# EAGLE design Micromouse (EAGLE 8.1.1)
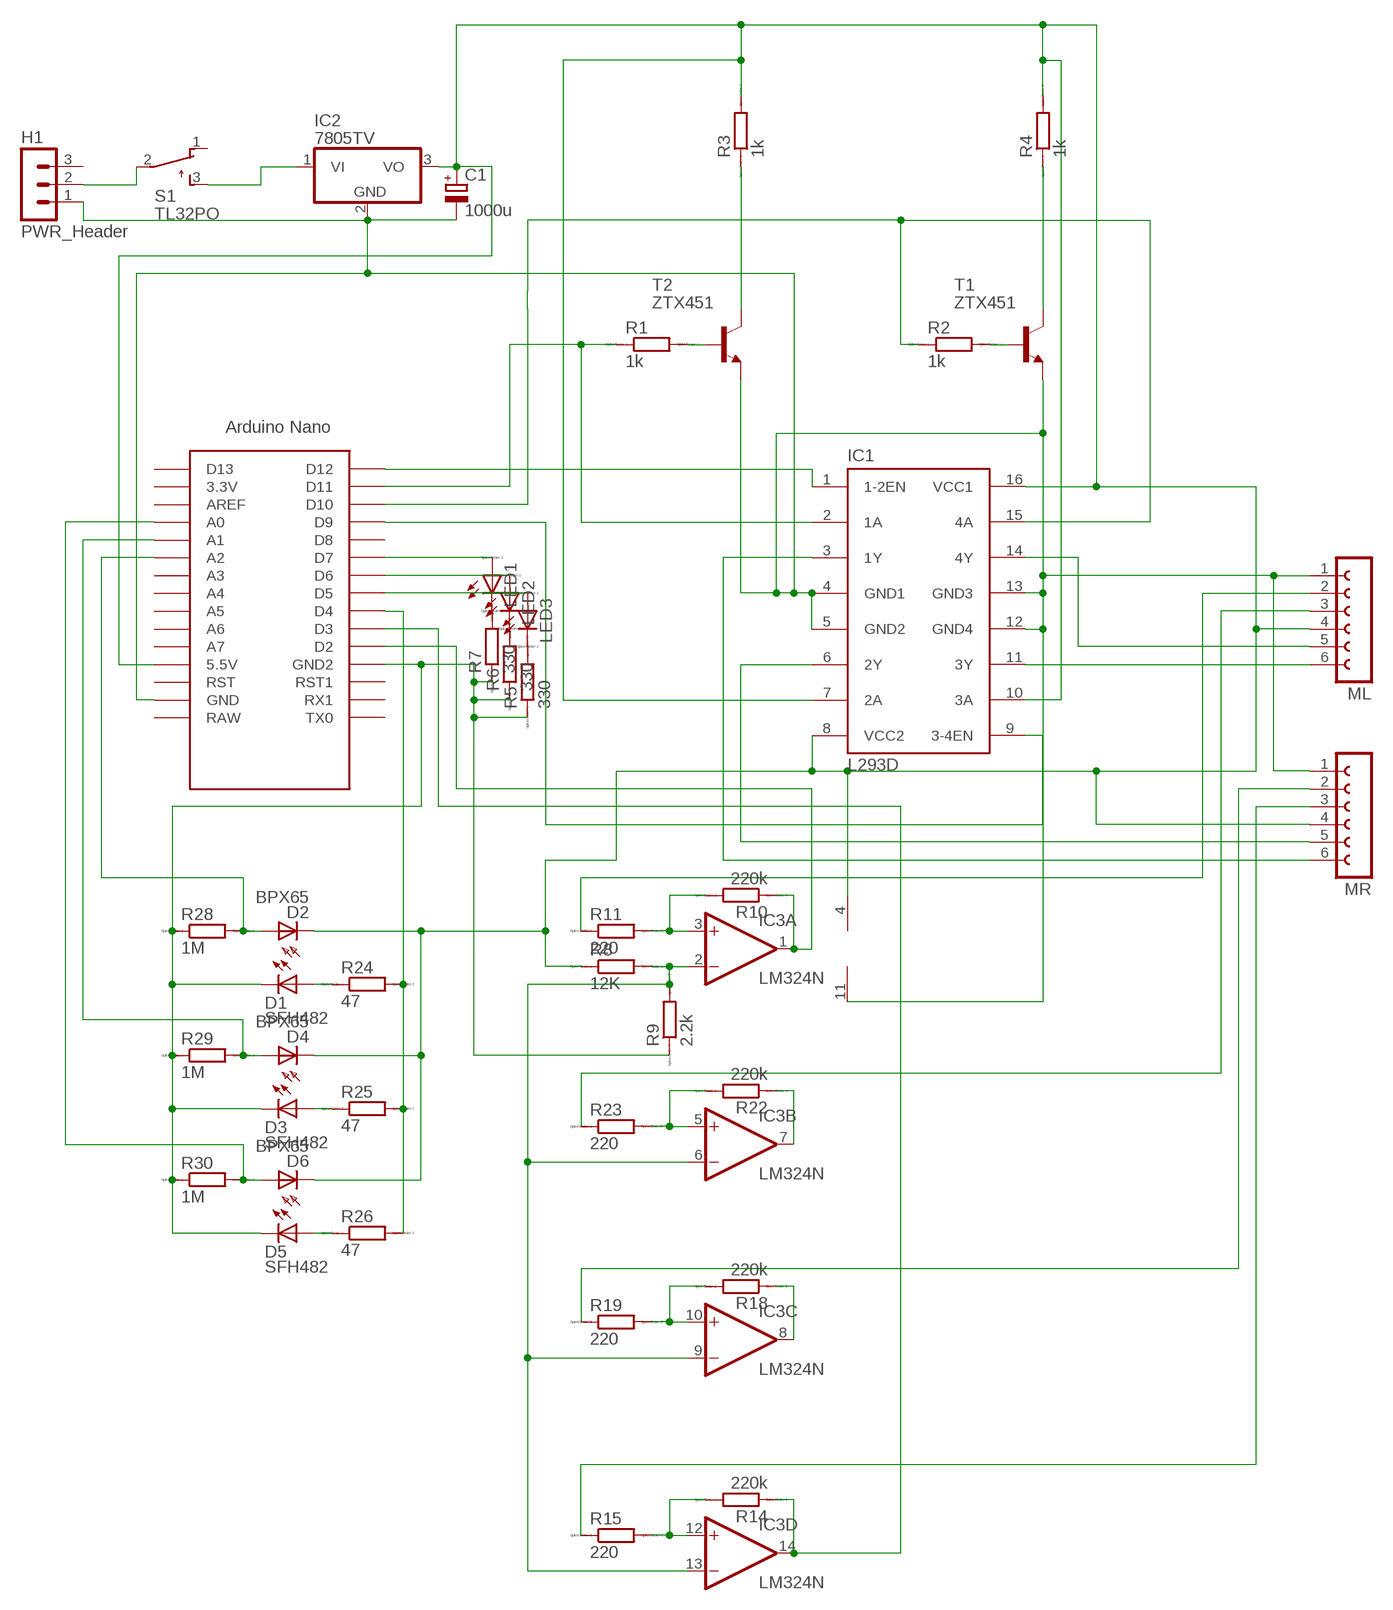
[diagram p0: schematic, sheet 1]

## Parts
C1  1000u  CPOL-EUE3.5-10  [E3,5-10]
D1  SFH482  [SFH482]
D2  BPX65  [BPX65]
D3  SFH482  [SFH482]
D4  BPX65  [BPX65]
D5  SFH482  [SFH482]
D6  BPX65  [BPX65]
H1  PWR_Header  MA03-1  [MA03-1]
IC1  L293D  [DIL16]
IC2  7805TV  [TO220V]
IC3  LM324N  [DIL14]
LED1  LED_ELD260  [LED_LD260]
LED2  LED_ELD260  [LED_LD260]
LED3  LED_ELD260  [LED_LD260]
ML  FE06-1  [FE06]
MR  FE06-1  [FE06]
R1  1k  R0204/7  [0204/7]
R2  1k  R0204/7  [0204/7]
R3  1k  R0204/7  [0204/7]
R4  1k  R0204/7  [0204/7]
R5  330  R0204/7  [0204/7]
R6  330  R0204/7  [0204/7]
R7  330  R0204/7  [0204/7]
R8  12K  R0204/7  [0204/7]
R9  2.2k  R0204/7  [0204/7]
R10  220k  R0204/7  [0204/7]
R11  220  R0204/7  [0204/7]
R14  220k  R0204/7  [0204/7]
R15  220  R0204/7  [0204/7]
R18  220k  R0204/7  [0204/7]
R19  220  R0204/7  [0204/7]
R22  220k  R0204/7  [0204/7]
R23  220  R0204/7  [0204/7]
R24  47  R0204/7  [0204/7]
R25  47  R0204/7  [0204/7]
R26  47  R0204/7  [0204/7]
R28  1M  R0204/7  [0204/7]
R29  1M  R0204/7  [0204/7]
R30  1M  R0204/7  [0204/7]
S1  TL32PO  [TL3XPO]
T1  ZTX451  BC238  [TO92]
T2  ZTX451  BC238  [TO92]
U$1  NANO  [NANO]

## Nets
5V: C1.+ D2.K(C) D4.K(C) D6.K(C) IC1.8(VCC2) IC1.10(3A) IC1.16(VCC1) IC2.3(VO) IC3.4(P:V+) ML.4 MR.4 R3.2 R4.2 R8.1 U$1.5V(5.5V)
GND: C1.- D1.K(C) D3.K(C) D5.K(C) H1.1 IC1.4(GND1) IC1.5(GND2) IC1.12(GND4) IC1.13(GND3) IC2.2(GND) IC3.11(P:V-) ML.1 MR.1 R5.1 R6.1 R7.1 R9.1 R28.1 R29.1 R30.1 T1.1(E) T2.1(E) U$1.GND U$1.GND1(GND2)
N$1: IC1.11(3Y) ML.6
N$2: IC1.14(4Y) ML.5
N$3: IC1.3(1Y) MR.6
N$4: IC1.6(2Y) MR.5
N$5: R1.2 T2.2(B)
N$6: R2.2 T1.2(B)
N$7: IC1.15(4A) R2.1 U$1.D10
N$8: IC1.2(1A) R1.1 U$1.D11
N$9: H1.2 S1.2(P)
N$10: IC1.1(1-2EN) U$1.D12
N$11: R3.1 T2.3(C)
N$12: R4.1 T1.3(C)
N$13: IC3.7(B:OUT) R22.1
N$15: LED3.K(C) R5.2
N$16: IC1.9(3-4EN) U$1.D9
N$19: LED2.K(C) R6.2
N$20: LED1.K(C) R7.2
N$22: IC3.1(A:OUT) R10.1 U$1.D2
N$23: IC3.3(A:+IN) R10.2 R11.2
N$24: LED1.A U$1.D7
N$25: LED2.A U$1.D6
N$26: LED3.A U$1.D5
N$27: IC3.2(A:-IN) IC3.6(B:-IN) IC3.9(C:-IN) IC3.13(D:-IN) R8.2 R9.2
N$28: IC3.8(C:OUT) R18.1
N$29: ML.2 R11.1
N$30: ML.3 R23.1
N$31: IC3.14(D:OUT) R14.1 U$1.D3
N$32: IC3.12(D:+IN) R14.2 R15.2
N$34: MR.2 R19.1
N$35: MR.3 R15.1
N$36: R24.2 R25.2 R26.2 U$1.D4
N$37: IC3.10(C:+IN) R18.2 R19.2
N$39: D4.A R29.2 U$1.A1
N$40: D5.A R26.1
N$42: IC3.5(B:+IN) R22.2 R23.2
N$44: D3.A R25.1
N$45: D1.A R24.1
N$46: D2.A R28.2 U$1.A2
N$48: D6.A R30.2 U$1.A0
VI: IC2.1(VI) S1.3(S)
Unconnected: H1.3 IC1.7(2A) S1.1(O) U$1.3.3V U$1.A3 U$1.A4 U$1.A5 U$1.A6 U$1.A7 U$1.AREF U$1.D8 U$1.D13 U$1.ICSP1 U$1.ICSP2 U$1.ICSP3 U$1.ICSP4 U$1.ICSP5 U$1.ICSP6 U$1.RAW U$1.RST U$1.RST1 U$1.RX1 U$1.TX0

## Library data of the parts
C1 = resistor:CPOL-EU: POLARIZED CAPACITOR, European symbol
D1 D3 D5 = led:SFH482: IR LED infrared emitting diode, Infineon
D2 D4 D6 = opto-trans-siemens:BPX65: PHOTO DIODE; MPN: BPX65.; OC_FARNELL: 327451; OC_NEWARK: 06WX2764
H1 = con-lstb:MA03-1: PIN HEADER; OC_FARNELL: unknown; OC_NEWARK: unknown
IC1 = st-microelectronics:L293D: PUSH-PULL 4 CHANNEL DRIVER; MPN: L293D; OC_FARNELL: 9589619; OC_NEWARK: 56P8249
IC2 = linear:78*: Positive VOLTAGE REGULATOR Source: http://cache.national.com/ds/LM/LM78L05.pdf http://www.fairchildsemi.com/ds/LM/LM7805.pdf
IC3 = linear:LM324: OP AMP
LED1-LED3 = eagle-ltspice:LED_E: LED Source: http://www.osram.convergy.de Source: www.luxeon.com Source: www.kingbright.com; SPICEMODEL: NONE; SPICEPREFIX: D; SPICETYPE: diode
ML MR = con-lsta:FE06-1: FEMALE HEADER; OC_FARNELL: unknown; OC_NEWARK: unknown
R1-R11 R14 R15 R18 R19 R22-R26 R28-R30 = eagle-ltspice:R: RESISTOR, European symbol; SPICEMODEL: NONE; SPICEPREFIX: R
S1 = switch:TL32PO: TINY SWITCH ON - MOM Source: http://www2.produktinfo.conrad.com/datenblaetter/700000-724999/705152-da-01-de-Subminiaturschalter_TL_36YO.pdf
T1 T2 = transistor:BC238: NPN TRANSISTOR
U$1 = Arduino-clone:NANO: Arduino Nano

## Board
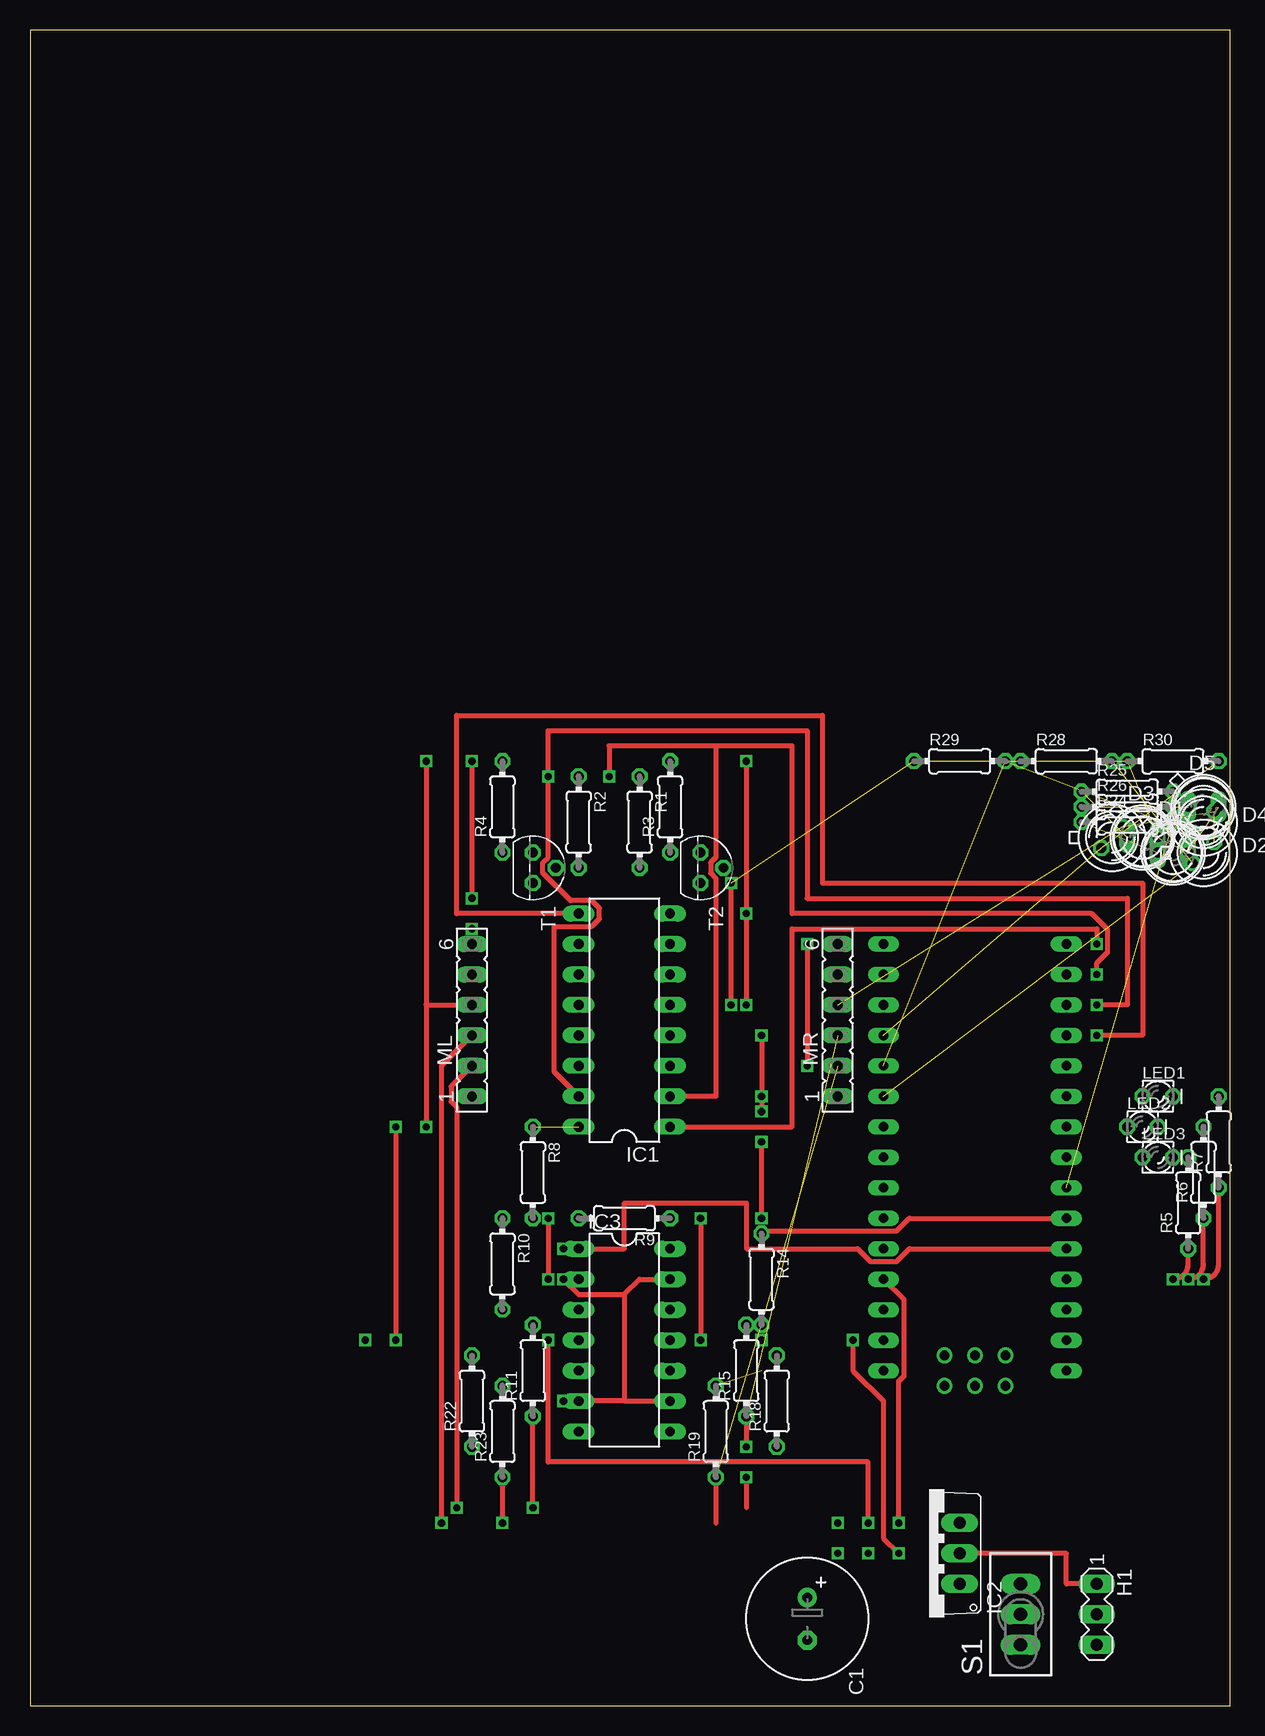
[diagram p1: board, top side]
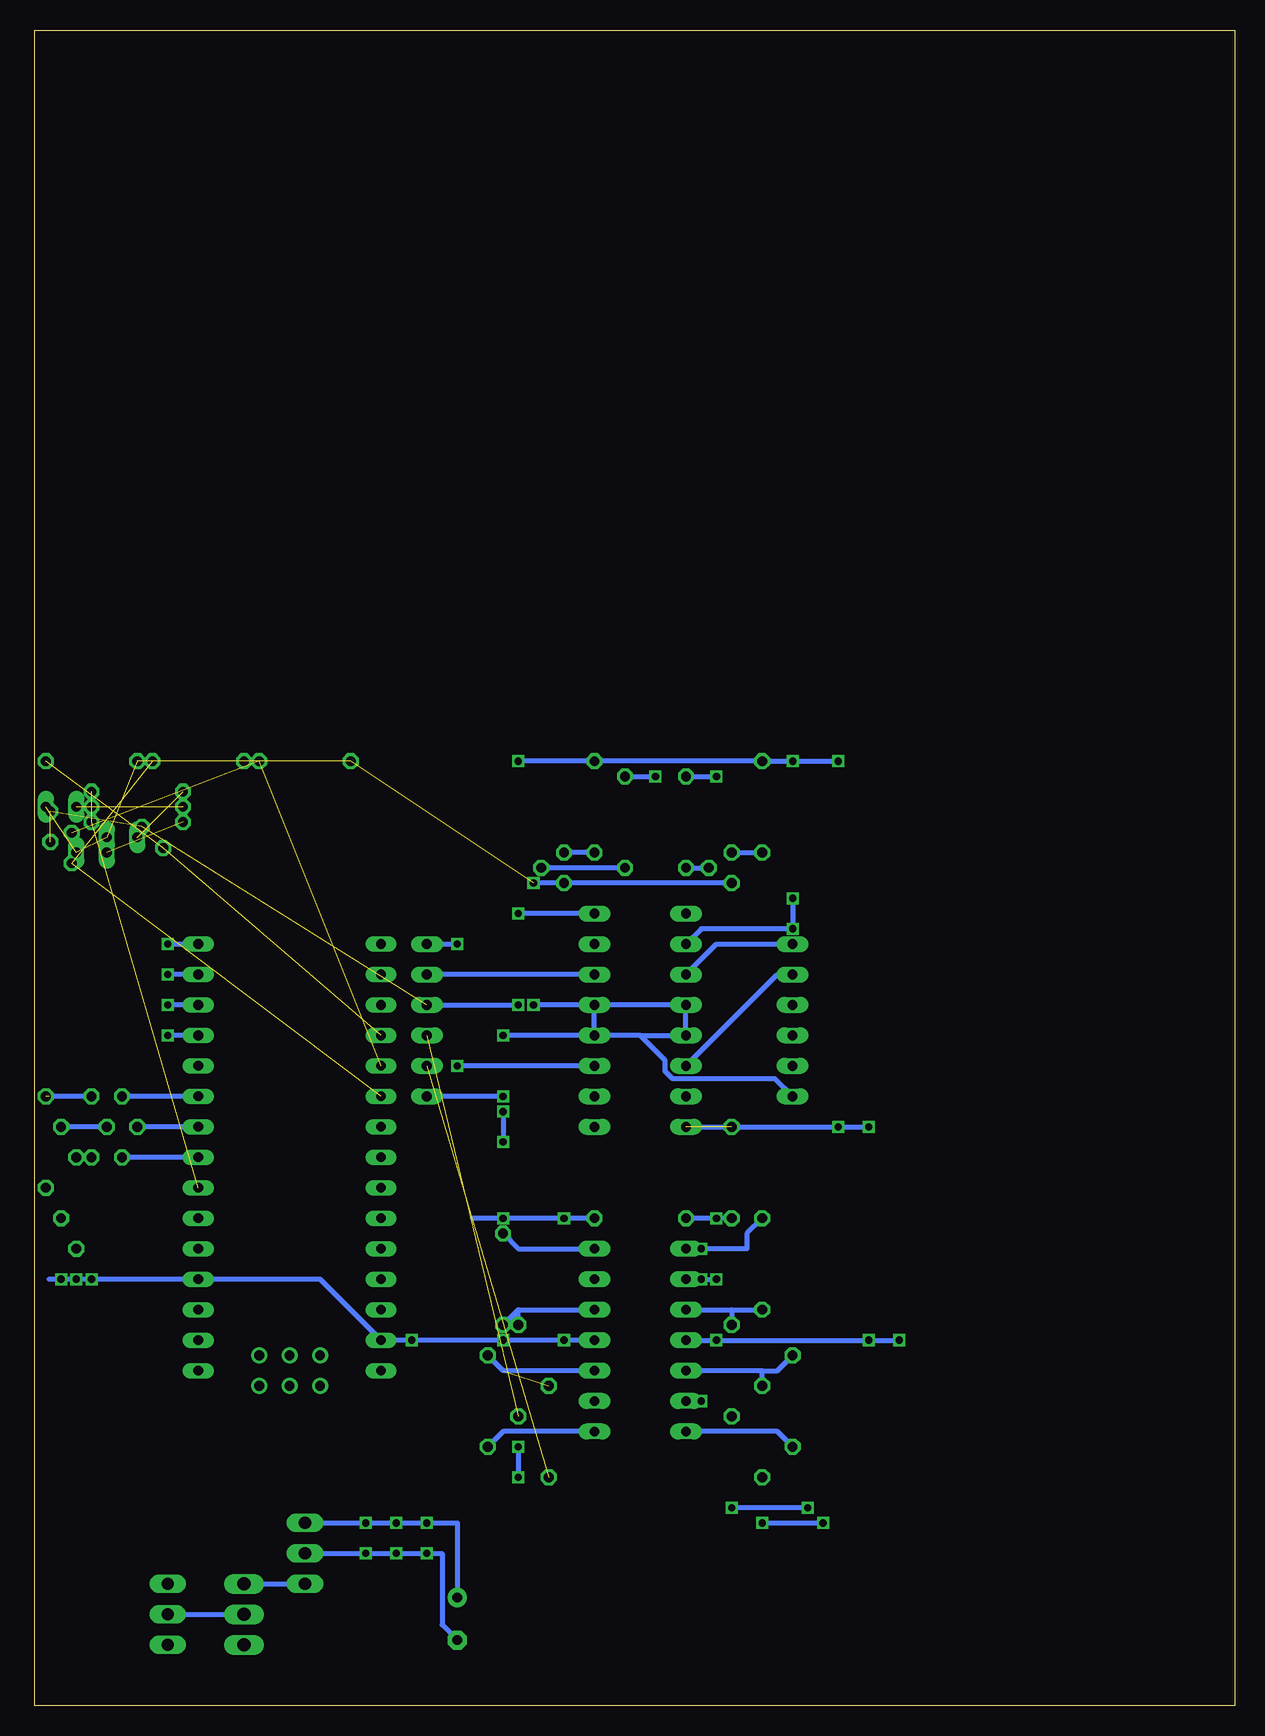
[diagram p2: board, bottom side, seen from below]

Size 100 x 139.69 mm. Coordinates in mm from the lower left corner, seen from the top.
Outline: 0,0 100,0 100,139.69 0,139.69 0,0
Copper layers (1*16): Top 0.035mm / dielectric 1.5mm / Bottom 0.035mm
Design rules "default": minimum track width 10mil, minimum drill 24mil, track to track 8mil, track to pad 8mil, pad to pad 8mil, via to via 8mil, smd to smd 8mil, copper to edge 40mil, drill to drill 8mil, minimum pad ring 10mil, minimum via ring 8mil, stop-mask expansion 4mil, vias tented up to drill 0mil, thermal gap 10mil

### Footprints (pad centres in the part's own frame; a part is rotated, then mirrored left to right if it is on the bottom)
E3,5-10 = drill 0.813 pad 1.6: + -1.778,0 | drill 0.813 pad 1.6 octagon: - 1.778,0
SFH482 = drill 0.813 long: A -1.27,0; K 1.27,0
BPX65 = drill 0.813 octagon: A -0.889,-0.889; K 0.889,0.889
MA03-1 = drill 1.016 long: 1 -2.54,0; 2 0,0; 3 2.54,0
DIL16 = drill 0.813 long: 1 -8.89,-3.81; 2 -6.35,-3.81; 3 -3.81,-3.81; 4 -1.27,-3.81; 5 1.27,-3.81; 6 3.81,-3.81; 7 6.35,-3.81; 8 8.89,-3.81; 9 8.89,3.81; 10 6.35,3.81; 11 3.81,3.81; 12 1.27,3.81; 13 -1.27,3.81; 14 -3.81,3.81; 15 -6.35,3.81; 16 -8.89,3.81
TO220V = drill 1.016 long: 1 -2.54,-2.54; 2 0,-2.54; 3 2.54,-2.54
DIL14 = drill 0.813 long: 1 -7.62,-3.81; 2 -5.08,-3.81; 3 -2.54,-3.81; 4 0,-3.81; 5 2.54,-3.81; 6 5.08,-3.81; 7 7.62,-3.81; 8 7.62,3.81; 9 5.08,3.81; 10 2.54,3.81; 11 0,3.81; 12 -2.54,3.81; 13 -5.08,3.81; 14 -7.62,3.81
LED_LD260 = drill 0.813 octagon: A -1.27,0; K 1.27,0
FE06 = drill 0.813 long: 1 -6.35,0; 2 -3.81,0; 3 -1.27,0; 4 1.27,0; 5 3.81,0; 6 6.35,0
0204/7 = drill 0.813 octagon: 1 -3.81,0; 2 3.81,0
TL3XPO = drill 1.1 pad 1.422 long: 1 -2.54,0; 2 0,0; 3 2.54,0
TO92 = drill 0.813 octagon: 1 1.27,0; 2 0,1.905; 3 -1.27,0
NANO = drill 0.8 long: 3.3V -10.16,24.13; 5V -10.16,-1.27; A0 -10.16,19.05; A1 -10.16,16.51; A2 -10.16,13.97; A3 -10.16,11.43; A4 -10.16,8.89; A5 -10.16,6.35; A6 -10.16,3.81; A7 -10.16,1.27; AREF -10.16,21.59; D2 5.08,1.27; D3 5.08,3.81; D4 5.08,6.35; D5 5.08,8.89; D6 5.08,11.43; D7 5.08,13.97; D8 5.08,16.51; D9 5.08,19.05; D10 5.08,21.59; D11 5.08,24.13; D12 5.08,26.67; D13 -10.16,26.67; GND -10.16,-6.35; GND1 5.08,-1.27; RAW -10.16,-8.89; RST -10.16,-3.81; RST1 5.08,-3.81; RX1 5.08,-6.35; TX0 5.08,-8.89 | drill 0.8: ICSP1 -5.08,-10.16; ICSP2 -5.08,-7.62; ICSP3 -2.54,-10.16; ICSP4 -2.54,-7.62; ICSP5 0,-10.16; ICSP6 0,-7.62

### Placement (x,y rotation side)
C1  64.77,7.25 270 top
D1  95.25,71.12 0 top
D2  97.79,71.12 0 top
D3  92.71,72.39 0 top
D4  97.79,73.66 0 top
D5  97.79,74.93 0 top
D6  90.17,72.39 0 top
H1  88.9,7.62 270 top
IC1  49.53,57.15 90 top
IC2  74.93,12.7 90 top
IC3  49.53,30.48 270 top
LED1  93.98,50.8 0 top
LED2  92.71,48.26 0 top
LED3  93.98,45.72 0 top
ML  36.83,57.15 90 top
MR  67.31,57.15 90 top
R1  50.8,73.66 270 top
R2  45.72,73.66 270 top
R3  53.34,74.93 90 top
R4  39.37,74.93 90 top
R5  96.52,41.91 90 top
R6  97.79,44.45 90 top
R7  99.06,46.99 90 top
R8  41.91,44.45 270 top
R9  49.53,40.64 180 top
R10  39.37,36.83 270 top
R11  41.91,27.94 90 top
R14  60.96,35.56 270 top
R15  59.69,27.94 90 top
R18  62.23,25.4 90 top
R19  57.15,22.86 90 top
R22  36.83,25.4 90 top
R23  39.37,22.86 90 top
R24  91.44,73.66 0 top
R25  91.44,76.2 0 top
R26  91.44,74.93 0 top
R28  86.36,78.74 0 top
R29  77.47,78.74 0 top
R30  95.25,78.74 0 top
S1  82.55,7.62 90 top
T1  41.91,69.85 270 top
T2  55.88,69.85 270 top
U$1  81.28,36.83 0 top

### Tracks (layer width: path | path; a pad name or v marks a point on that pad's centre or on a via)
5V  (via drill 0.6)  (4 unrouted)
  Top 0.406: v72.39,15.24 72.39,27.06 72.83,27.5 72.83,33.85 U$1.5V | v69.85,15.24 69.85,20.32 43.18,20.32 v43.18,30.48 | v30.48,48.26 v30.48,30.48 | v33.02,78.74 33.02,58.42 | 33.02,58.42 v33.02,48.26 | 33.02,58.42 ML.4 | v59.69,78.74 v59.69,66.04 v59.69,58.42 | v36.83,78.74 v36.83,67.31
  Bottom 0.406: IC2.3 v72.39,15.24 v69.85,15.24 v67.31,15.24 64.77,15.24 C1.+ | IC3.4 v43.18,30.48 v30.48,30.48 v27.94,30.48 | IC1.16 v33.02,48.26 v30.48,48.26 | v33.02,78.74 v36.83,78.74 R4.2 R3.2 v59.69,78.74 | IC1.8 v59.69,66.04 | MR.4 v59.69,58.42 | IC1.10 44.45,64.77 v36.83,64.77 v36.83,67.31
GND  (via drill 0.6)  (6 unrouted)
  Top 0.406: H1.1 86.36,10.16 86.36,12.7 IC2.2 | v97.79,35.56 arc90 99.06,36.83 R7.1 | v96.52,35.56 arc90 97.79,36.83 R6.1 | v95.25,35.56 arc90 96.52,36.83 R5.1 | v68.58,30.48 68.58,27.94 71.12,25.4 71.12,13.97 v72.39,12.7 | v58.42,58.42 v58.42,68.58 | v55.88,40.64 v55.88,30.48 | v60.96,55.88 v60.96,50.8 v60.96,49.53 | v60.96,40.64 v60.96,46.99
  Bottom 0.406: 98.78,35.56 v97.79,35.56 v96.52,35.56 v95.25,35.56 U$1.GND1 76.2,35.56 U$1.GND v68.58,30.48 v60.96,30.48 v55.88,30.48 IC3.11 | IC2.2 v72.39,12.7 v69.85,12.7 v67.31,12.7 66.04,12.7 66.04,6.74 C1.- | IC1.4 v60.96,55.88 | IC1.4 IC1.5 | 49.53,55.88 IC1.13 IC1.12 IC1.5 | 49.53,55.88 IC1.4 | IC1.5 v58.42,58.42 | v58.42,68.58 T2.1 T1.1 | R9.1 v55.88,40.64 v60.96,40.64 63.5,40.64 | v60.96,49.53 v60.96,46.99 | ML.1 38.3,52.27 46.82,52.27 47.45,52.9 47.45,53.8 49.53,55.88 | v60.96,50.8 MR.1
N$1
  Bottom 0.406: IC1.11 43.18,63.5 ML.6
N$2
  Bottom 0.406: IC1.14 38.1,60.96 ML.5
N$3  (via drill 0.6)
  Top 0.406: v64.77,63.5 v64.77,53.34
  Bottom 0.406: IC1.3 v64.77,53.34 | MR.6 v64.77,63.5
N$4
  Bottom 0.406: IC1.6 MR.5
N$5
  Bottom 0.406: R1.2 T2.2
N$6
  Bottom 0.406: R2.2 T1.2
N$7  (via drill 0.6)
  Top 0.406: v88.9,58.42 91.44,58.42 91.44,67.31 64.77,67.31 64.77,81.28 43.18,81.28 v43.18,77.47 43.18,70.72 42.75,70.29 42.75,69.41 45.05,67.11 46.82,67.11 47.45,66.48 47.45,65.6 46.82,64.97 43.7,64.97 43.7,52.82 IC1.15
  Bottom 0.406: R2.1 v43.18,77.47 | U$1.D10 v88.9,58.42
N$8  (via drill 0.6)
  Top 0.406: v88.9,60.96 88.9,61.92 89.81,62.83 89.81,64.72 88.49,66.04 63.5,66.04 63.5,80.01 57.15,80.01 | 57.15,80.01 48.26,80.01 v48.26,77.47 | 57.15,80.01 57.15,70.72 56.72,70.29 56.72,69.41 57.15,68.98 57.15,50.8 IC1.2
  Bottom 0.406: R1.1 v48.26,77.47 | U$1.D11 v88.9,60.96
N$9
  Bottom 0.406: H1.2 S1.2
N$10  (via drill 0.6)
  Top 0.406: IC1.1 63.5,48.26 63.5,64.77 88.9,64.77 v88.9,63.5
  Bottom 0.406: v88.9,63.5 U$1.D12
N$11
  Bottom 0.406: R3.1 T2.3
N$12
  Bottom 0.406: T1.3 R4.1
N$13
  Bottom 0.406: R22.1 38.1,22.86 IC3.7
N$15
  Bottom 0.406: LED3.K R5.2
N$16  (via drill 0.6)
  Top 0.406: IC1.9 35.56,66.04 35.56,82.55 66.04,82.55 66.04,68.58 92.71,68.58 92.71,55.88 v88.9,55.88
  Bottom 0.406: U$1.D9 v88.9,55.88
N$19
  Bottom 0.406: LED2.K R6.2
N$20  (1 unrouted)
  Bottom 0.406: LED1.K 98.78,50.8
N$22  (via drill 0.6)
  Top 0.406: IC3.1 49.53,38.1 49.53,41.91 59.69,41.91 59.69,38.1 68.97,38.1 70.03,37.04 72.21,37.04 73.27,38.1 U$1.D2
  Bottom 0.406: R10.1 40.64,39.37 40.64,38.1 v44.45,38.1 IC3.1
N$23
  Bottom 0.406: IC3.3 41.91,33.02 | 41.91,33.02 R10.2 | 41.91,33.02 R11.2
N$24
  Bottom 0.406: U$1.D7 LED1.A
N$25
  Bottom 0.406: U$1.D6 LED2.A
N$26
  Bottom 0.406: U$1.D5 LED3.A
N$27  (via drill 0.6)
  Top 0.406: v43.18,40.64 v43.18,35.56 | v44.45,35.56 45.72,34.29 49.53,34.29 | 49.53,34.29 50.8,35.56 IC3.13 | 49.53,34.29 49.53,25.4 | 49.53,25.4 IC3.6 | 49.53,25.4 IC3.9
  Bottom 0.406: IC3.2 v44.45,35.56 v43.18,35.56 | R8.2 v43.18,40.64 R9.2 | IC3.6 v44.45,25.4
N$28
  Bottom 0.406: R18.1 60.96,22.86 IC3.8
N$29  (via drill 0.6)
  Top 0.406: v41.91,16.51 R11.1 | v35.56,16.51 35.56,49.9 35.1,50.36 35.1,51.61 ML.2
  Bottom 0.406: v35.56,16.51 v41.91,16.51
N$30  (via drill 0.6)
  Top 0.406: R23.1 v39.37,15.24 | ML.3 34.29,53.34 v34.29,15.24
  Bottom 0.406: v39.37,15.24 v34.29,15.24
N$31
  Top 0.406: U$1.D3 73.27,40.64 72.21,39.58 61.17,39.58 R14.1
  Bottom 0.406: R14.1 59.69,38.1 IC3.14
N$32
  Bottom 0.406: 59.69,33.02 IC3.12 | 59.69,33.02 R14.2 | R15.2 59.69,33.02
N$34  (1 unrouted)
  Top 0.406: R19.1 57.15,15.24
N$35  (via drill 0.6)  (1 unrouted)
  Top 0.406: R15.1 v59.69,21.59 | v59.69,19.05 59.69,16.51
  Bottom 0.406: v59.69,21.59 v59.69,19.05
N$36  (3 unrouted)
N$37  (1 unrouted)
  Bottom 0.406: R18.2 60.96,27.94 IC3.10
N$39  (2 unrouted)
N$40  (1 unrouted)
N$42
  Bottom 0.406: R22.2 38.1,27.94 39.37,27.94 | 39.37,27.94 IC3.5 | R23.2 39.37,27.94
N$44  (1 unrouted)
N$45  (1 unrouted)
N$46  (2 unrouted)
N$48  (2 unrouted)
VI
  Bottom 0.406: S1.3 IC2.1